# EAGLE design 8stepsv2 (EAGLE 7.4.0)
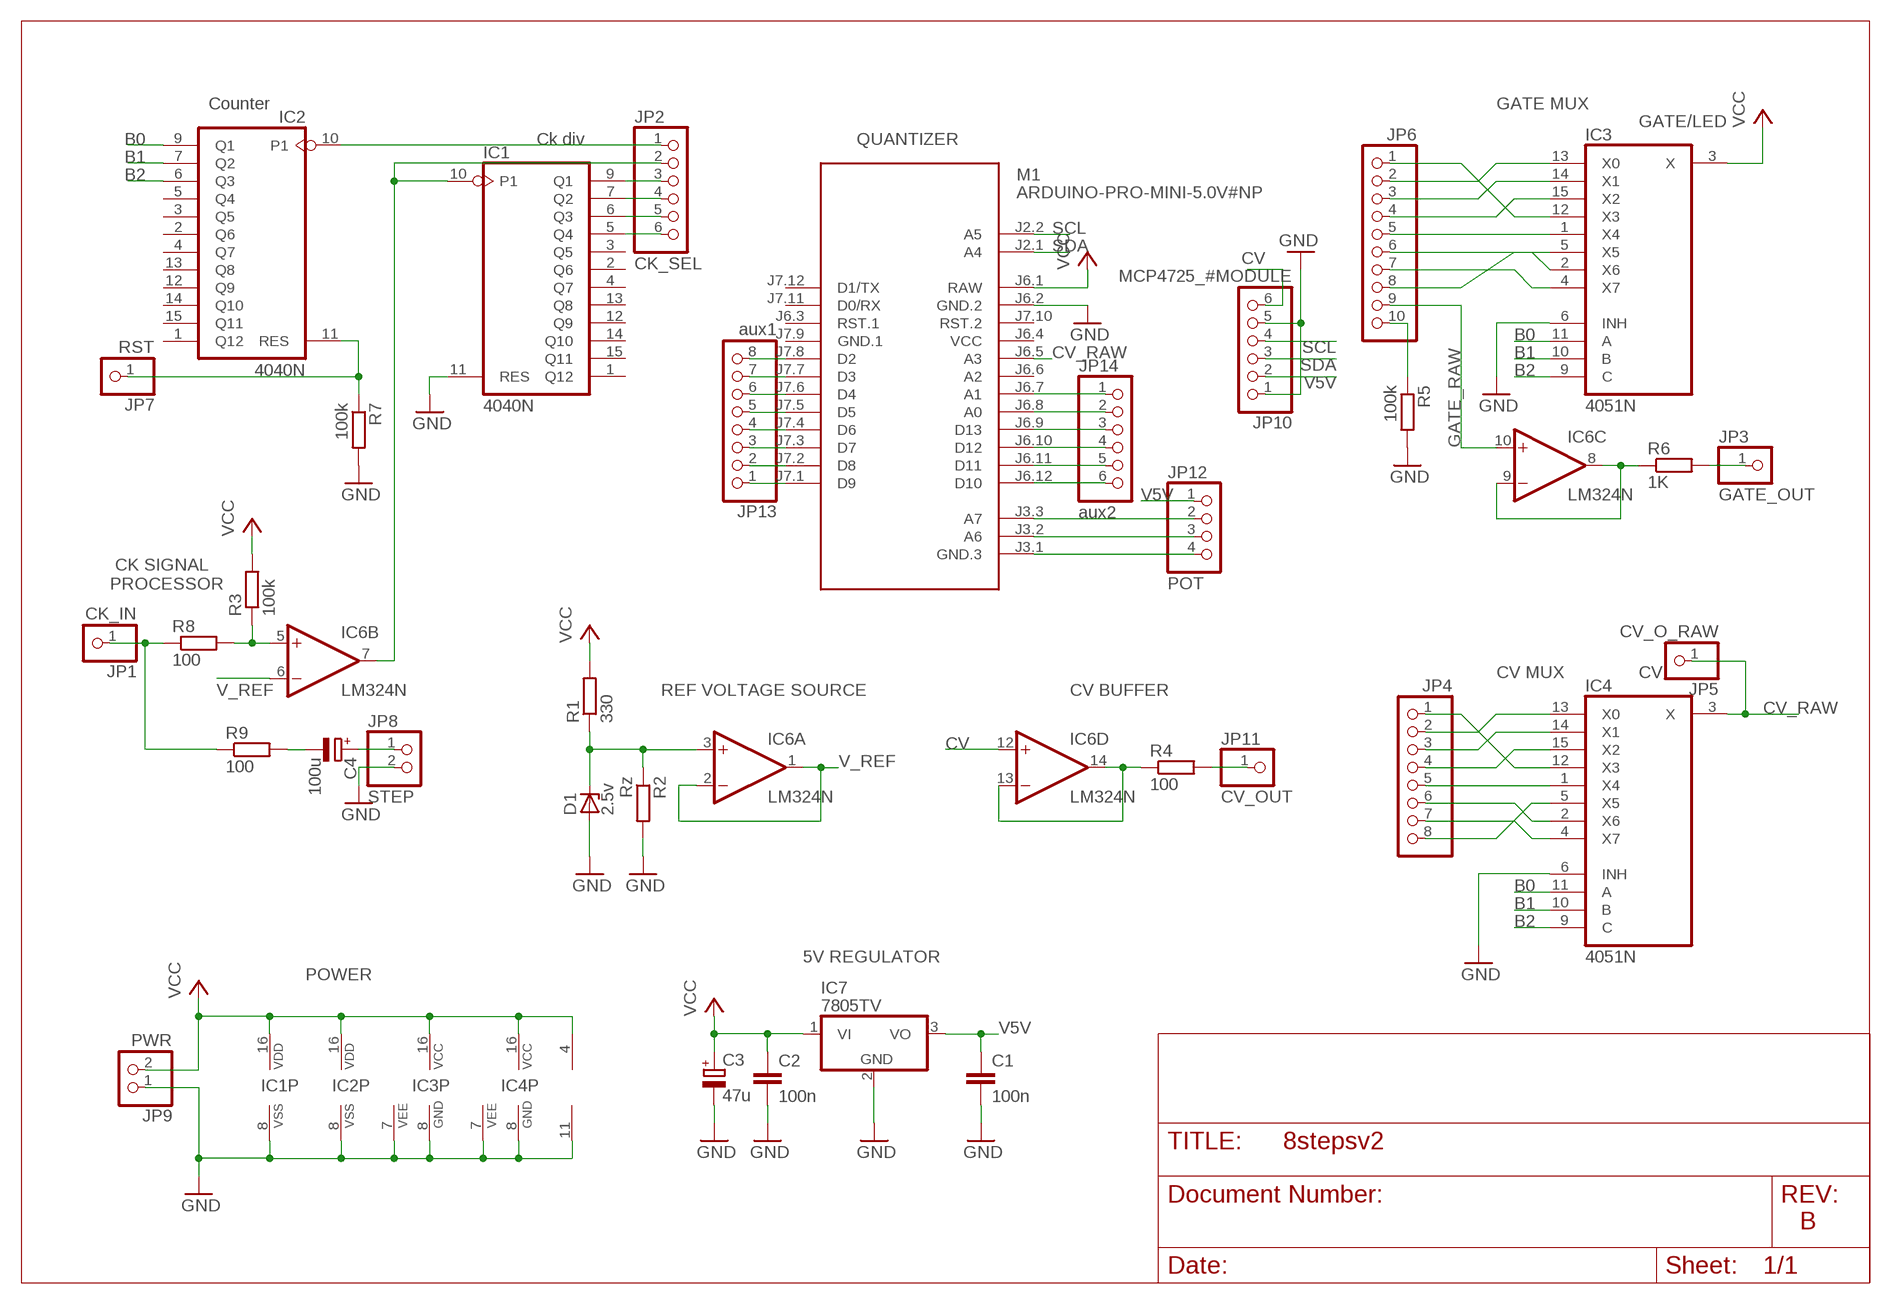
[diagram p0: schematic, sheet 1]

## Parts
C1  100n  C-EU050-025X075  [C050-025X075]
C2  100n  C-EU050-025X075  [C050-025X075]
C3  47u  CPOL-EUE2.5-7  [E2,5-7]
C4  100u  CPOL-EUE2.5-7  [E2,5-7]
D1  2.5v  ZENER-DIODEZD-2.5  [ZDIO-2.5]
IC1  4040N  [DIL16]
IC2  4040N  [DIL16]
IC3  4051N  [DIL16]
IC4  4051N  [DIL16]
IC6  LM324N  [DIL14]
IC7  7805TV  [TO220V]
JP1  CK_IN  PINHD-1X1  [1X01]
JP2  CK_SEL  PINHD-1X6  [1X06]
JP3  GATE_OUT  PINHD-1X1  [1X01]
JP4  PINHD-1X8  [1X08]
JP5  CV_O_RAW  PINHD-1X1  [1X01]
JP6  PINHD-1X10  [1X10]
JP7  RST  PINHD-1X1  [1X01]
JP8  STEP  PINHD-1X2  [1X02]
JP9  PWR  PINHD-1X2  [1X02]
JP10  MCP4725_#MODULE  PINHD-1X6  [1X06]
JP11  CV_OUT  PINHD-1X1  [1X01]
JP12  POT  PINHD-1X4  [1X04]
JP13  aux1  PINHD-1X8  [1X08]
JP14  aux2  PINHD-1X6  [1X06]
M1  ARDUINO-PRO-MINI-5.0V#NP  [ARDUINO-PRO-MINI#NP]
R1  330  R-EU_0207/2V  [0207/2V]
R2  Rz  R-EU_0207/2V  [0207/2V]
R3  100k  R-EU_0207/2V  [0207/2V]
R4  100  R-EU_0207/2V  [0207/2V]
R5  100k  R-EU_0207/2V  [0207/2V]
R6  1K  R-EU_0207/2V  [0207/2V]
R7  100k  R-EU_0207/2V  [0207/2V]
R8  100  R-EU_0207/2V  [0207/2V]
R9  100  R-EU_0207/2V  [0207/2V]

## Nets
B0: IC2.9(Q1) IC3.11(A) IC4.11(A)
B1: IC2.7(Q2) IC3.10(B) IC4.10(B)
B2: IC2.6(Q3) IC3.9(C) IC4.9(C)
CV: IC6.12(D:+IN) JP10.6
CV_RAW: IC4.3(X) JP5.1 M1.J6.5(A3)
GATE_RAW: IC6.10(C:+IN) JP6.9
GND: C1.2 C2.2 C3.- D1.A IC1.8(VSS) IC1.11(RES) IC2.8(VSS) IC3.6(INH) IC3.7(VEE) IC3.8(GND) IC4.6(INH) IC4.7(VEE) IC4.8(GND) IC6.11(P:V-) IC7.2(GND) JP8.2 JP9.1 JP10.1 JP10.5 JP12.4 M1.J3.1(GND.3) M1.J6.2(GND.2) R2.2 R5.2 R7.2
N$1: D1.C IC6.3(A:+IN) R1.1 R2.1
N$2: JP1.1 R8.1 R9.1
N$3: JP13.1 M1.J7.1(D9)
N$4: IC1.10(P1) IC6.7(B:OUT) JP2.2
N$5: IC1.9(Q1) JP2.3
N$6: IC1.7(Q2) JP2.4
N$7: IC1.6(Q3) JP2.5
N$8: IC1.5(Q4) JP2.6
N$9: IC2.10(P1) JP2.1
N$10: IC3.12(X3) JP6.1
N$11: IC3.13(X0) JP6.2
N$12: IC3.14(X1) JP6.3
N$13: IC3.15(X2) JP6.4
N$14: IC3.2(X6) JP6.6
N$15: IC3.5(X5) JP6.8
N$16: IC3.4(X7) JP6.7
N$17: IC3.1(X4) JP6.5
N$18: IC4.12(X3) JP4.1
N$19: IC4.13(X0) JP4.2
N$20: IC4.14(X1) JP4.3
N$21: IC4.15(X2) JP4.4
N$22: IC4.1(X4) JP4.5
N$23: IC4.2(X6) JP4.6
N$24: IC4.4(X7) JP4.7
N$25: IC4.5(X5) JP4.8
N$26: IC6.13(D:-IN) IC6.14(D:OUT) R4.1
N$27: JP11.1 R4.2
N$28: JP6.10 R5.1
N$29: IC2.11(RES) JP7.1 R7.1
N$30: IC6.8(C:OUT) IC6.9(C:-IN) R6.1
N$31: JP3.1 R6.2
N$32: C4.- R9.2
N$33: IC6.5(B:+IN) R3.1 R8.2
N$34: C4.+ JP8.1
N$35: JP12.3 M1.J3.2(A6)
N$36: JP12.2 M1.J3.3(A7)
N$37: JP13.2 M1.J7.2(D8)
N$38: JP13.3 M1.J7.3(D7)
N$39: JP13.4 M1.J7.4(D6)
N$40: JP13.5 M1.J7.5(D5)
N$41: JP13.6 M1.J7.6(D4)
N$42: JP13.7 M1.J7.7(D3)
N$43: JP13.8 M1.J7.8(D2)
N$45: JP14.1 M1.J6.7(A1)
N$46: JP14.2 M1.J6.8(A0)
N$47: JP14.3 M1.J6.9(D13)
N$48: JP14.4 M1.J6.10(D12)
N$49: JP14.5 M1.J6.11(D11)
N$50: JP14.6 M1.J6.12(D10)
SCL: JP10.4 M1.J2.2(A5)
SDA: JP10.3 M1.J2.1(A4)
V5V: C1.1 IC7.3(VO) JP10.2 JP12.1
V_REF: IC6.1(A:OUT) IC6.2(A:-IN) IC6.6(B:-IN)
VCC: C2.1 C3.+ IC1.16(VDD) IC2.16(VDD) IC3.3(X) IC3.16(VCC) IC4.16(VCC) IC6.4(P:V+) IC7.1(VI) JP9.2 M1.J6.1(RAW) R1.2 R3.2
Unconnected: IC1.1(Q12) IC1.2(Q6) IC1.3(Q5) IC1.4(Q7) IC1.12(Q9) IC1.13(Q8) IC1.14(Q10) IC1.15(Q11) IC2.1(Q12) IC2.2(Q6) IC2.3(Q5) IC2.4(Q7) IC2.5(Q4) IC2.12(Q9) IC2.13(Q8) IC2.14(Q10) IC2.15(Q11) M1.J6.3(RST.1) M1.J6.6(A2) M1.J7.10(RST.2) M1.J7.11(D0/RX) M1.J7.12(D1/TX)

## Notes on the sheet
- Counter | GATE MUX
- GATE/LED
- Ck div | QUANTIZER
- CK SIGNAL
  PROCESSOR
- CV MUX | CV
- REF VOLTAGE SOURCE | CV BUFFER
- 5V REGULATOR
- POWER
- B

## Power pins joined to a net without a drawn wire
GND.1: M1.J7.9(GND.1)
VCC: M1.J6.4(VCC)

## Library data of the parts
C1 C2 = rcl:C-EU: CAPACITOR, European symbol
C3 C4 = rcl:CPOL-EU: POLARIZED CAPACITOR, European symbol
D1 = diode:ZENER-DIODE: Z-Diode
IC1 IC2 = 40xx:4040: 12-stage binary/ripple COUNTER
IC3 IC4 = 40xx:4051: 8-channel ANALOG MULTIPLEXER
IC6 = linear:LM324: OP AMP
IC7 = linear:78*: Positive VOLTAGE REGULATOR Source: http://cache.national.com/ds/LM/LM78L05.pdf http://www.fairchildsemi.com/ds/LM/LM7805.pdf
JP1 JP3 JP5 JP7 JP11 = pinhead:PINHD-1X1: PIN HEADER
JP2 JP10 JP14 = pinhead:PINHD-1X6: PIN HEADER
JP4 JP13 = pinhead:PINHD-1X8: PIN HEADER
JP6 = pinhead:PINHD-1X10: PIN HEADER
JP8 JP9 = pinhead:PINHD-1X2: PIN HEADER
JP12 = pinhead:PINHD-1X4: PIN HEADER
M1 = diy-modules:ARDUINO-PRO-MINI-*#NP: Arduino Pro Mini (and compatible devices) without programming pads More details available here: https://www.arduino.cc/en/Main/ArduinoBoardProMini Click here to find device on ebay.com <http://www.ebay.com/sch/arduino+pro+mini>
R1-R9 = rcl:R-EU_: RESISTOR, European symbol

## Board
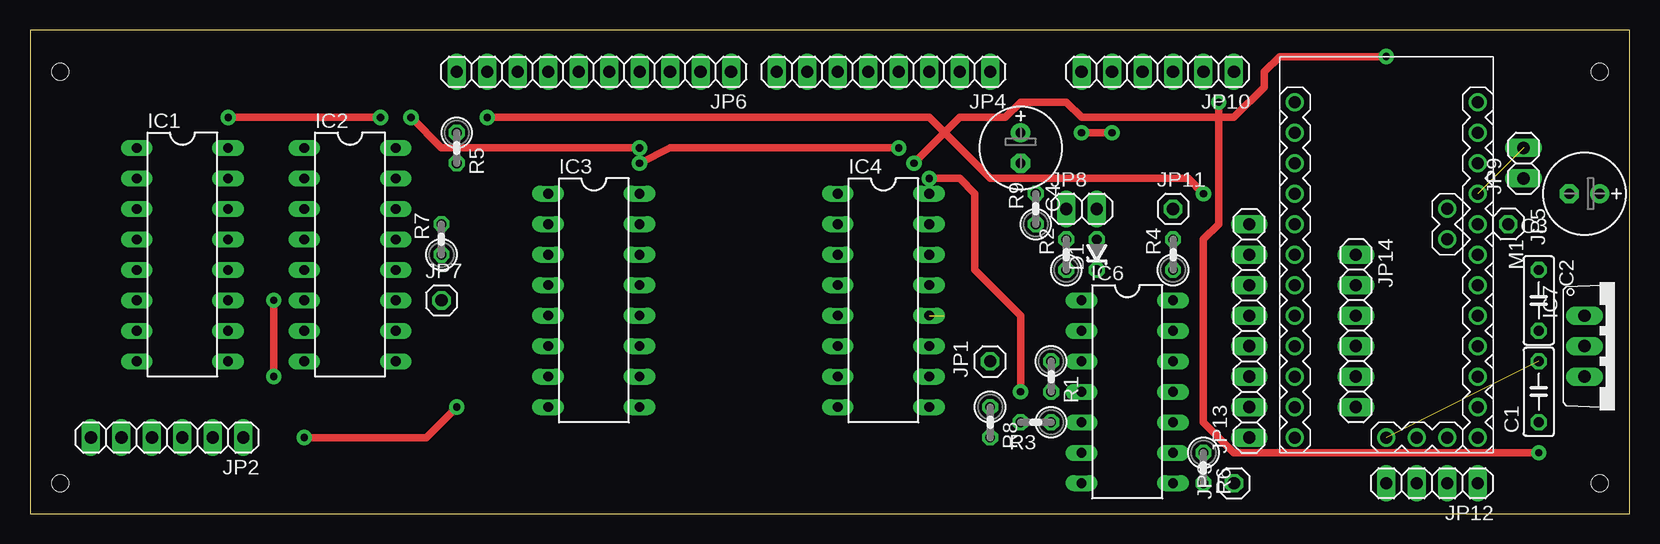
[diagram p1: board, top side]
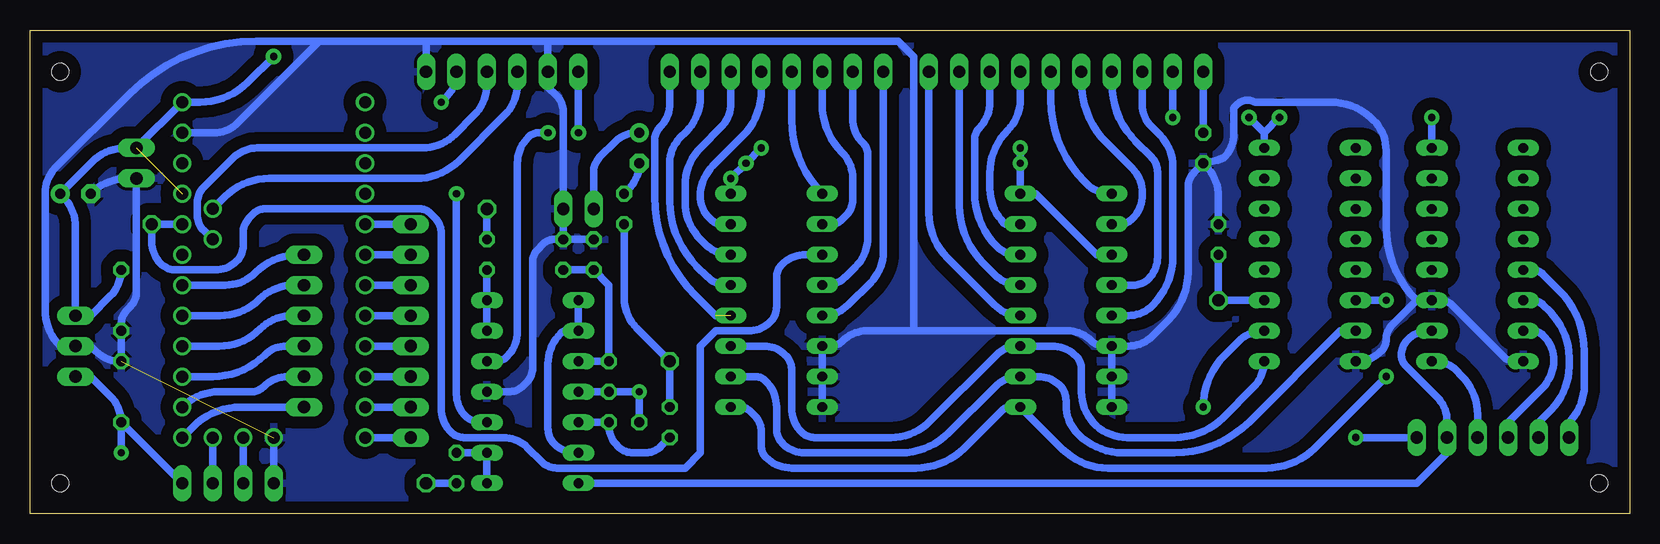
[diagram p2: board, bottom side, seen from below]

Size 133.33 x 40.31 mm. Coordinates in mm from the lower left corner, seen from the top.
Outline: 0,0 133.33,0 133.33,40.31 0,40.31 0,0
Copper layers (1*16): Top 0.035mm / dielectric 1.5mm / Bottom 0.035mm
Design rules "default": minimum track width 10mil, minimum drill 24mil, track to track 8mil, track to pad 8mil, pad to pad 8mil, via to via 8mil, smd to smd 8mil, copper to edge 40mil, drill to drill 8mil, minimum pad ring 10mil, minimum via ring 8mil, stop-mask expansion 4mil, vias tented up to drill 0mil, thermal gap 10mil
Holes 1.4 mm at 2.54,36.83 2.54,2.54 130.81,2.54 130.81,36.83

### Footprints (pad centres in the part's own frame; a part is rotated, then mirrored left to right if it is on the bottom)
C050-025X075 = drill 0.813 octagon: 1 -2.54,0; 2 2.54,0
E2,5-7 = drill 0.813 pad 1.6: + -1.27,0 | drill 0.813 pad 1.6 octagon: - 1.27,0
ZDIO-2.5 = drill 0.813 octagon: A 1.27,0; C -1.27,0
DIL16 = drill 0.813 long: 1 -8.89,-3.81; 2 -6.35,-3.81; 3 -3.81,-3.81; 4 -1.27,-3.81; 5 1.27,-3.81; 6 3.81,-3.81; 7 6.35,-3.81; 8 8.89,-3.81; 9 8.89,3.81; 10 6.35,3.81; 11 3.81,3.81; 12 1.27,3.81; 13 -1.27,3.81; 14 -3.81,3.81; 15 -6.35,3.81; 16 -8.89,3.81
DIL14 = drill 0.813 long: 1 -7.62,-3.81; 2 -5.08,-3.81; 3 -2.54,-3.81; 4 0,-3.81; 5 2.54,-3.81; 6 5.08,-3.81; 7 7.62,-3.81; 8 7.62,3.81; 9 5.08,3.81; 10 2.54,3.81; 11 0,3.81; 12 -2.54,3.81; 13 -5.08,3.81; 14 -7.62,3.81
TO220V = drill 1.016 long: 1 -2.54,-2.54; 2 0,-2.54; 3 2.54,-2.54
1X01 = drill 1.016 octagon: 1 0,0
1X06 = drill 1.016 long: 1 -6.35,0; 2 -3.81,0; 3 -1.27,0; 4 1.27,0; 5 3.81,0; 6 6.35,0
1X08 = drill 1.016 long: 1 -8.89,0; 2 -6.35,0; 3 -3.81,0; 4 -1.27,0; 5 1.27,0; 6 3.81,0; 7 6.35,0; 8 8.89,0
1X10 = drill 1.016 long: 1 -11.43,0; 2 -8.89,0; 3 -6.35,0; 4 -3.81,0; 5 -1.27,0; 6 1.27,0; 7 3.81,0; 8 6.35,0; 9 8.89,0; 10 11.43,0
1X02 = drill 1.016 long: 1 -1.27,0; 2 1.27,0
1X04 = drill 1.016 long: 1 -3.81,0; 2 -1.27,0; 3 1.27,0; 4 3.81,0
ARDUINO-PRO-MINI#NP = drill 1: J2.1 -1.27,5.08; J2.2 -3.81,5.08; J3.1 15.24,0; J3.2 15.24,2.54; J3.3 15.24,5.08; J6.1 -12.7,7.62; J6.2 -10.16,7.62; J6.3 -7.62,7.62; J6.4 -5.08,7.62; J6.5 -2.54,7.62; J6.6 0,7.62; J6.7 2.54,7.62; J6.8 5.08,7.62; J6.9 7.62,7.62; J6.10 10.16,7.62; J6.11 12.7,7.62; J6.12 15.24,7.62; J7.1 15.24,-7.62; J7.2 12.7,-7.62; J7.3 10.16,-7.62; J7.4 7.62,-7.62; J7.5 5.08,-7.62; J7.6 2.54,-7.62; J7.7 0,-7.62; J7.8 -2.54,-7.62; J7.9 -5.08,-7.62; J7.10 -7.62,-7.62; J7.11 -10.16,-7.62; J7.12 -12.7,-7.62
0207/2V = drill 0.813 octagon: 1 -1.27,0; 2 1.27,0

### Placement (x,y rotation side)
C1  125.73,10.16 90 top
C2  125.73,17.78 270 top
C3  129.54,26.67 180 top
C4  82.55,30.48 270 top
D1  88.9,21.59 90 top
IC1  12.7,21.59 270 top
IC2  26.67,21.59 270 top
IC3  46.99,17.78 270 top
IC4  71.12,17.78 270 top
IC6  91.44,10.16 270 top
IC7  132.08,13.97 270 top
JP1  80.01,12.7 90 top
JP2  11.43,6.35 180 top
JP3  100.33,2.54 90 top
JP4  71.12,36.83 180 top
JP5  123.19,24.13 270 top
JP6  46.99,36.83 180 top
JP7  34.29,17.78 0 top
JP8  87.63,25.4 0 top
JP9  124.46,29.21 90 top
JP10  93.98,36.83 180 top
JP11  95.25,25.4 0 top
JP12  116.84,2.54 180 top
JP13  101.6,15.24 90 top
JP14  110.49,15.24 270 top
M1  113.03,21.59 270 top
R1  85.09,11.43 270 top
R2  86.36,21.59 90 top
R3  83.82,7.62 180 top
R4  95.25,21.59 90 top
R5  35.56,30.48 270 top
R6  97.79,3.81 270 top
R7  34.29,22.86 90 top
R8  80.01,7.62 270 top
R9  83.82,25.4 90 top

### Tracks (layer width: path | path; a pad name or v marks a point on that pad's centre or on a via)
B0
  Bottom 0.61: IC4.11 72.17,13.97 arc45 70.38,13.23 arc45 69.85,11.96 69.85,8.8 arc-45 69.02,6.79 arc-45 67.96,6.35 61.59,6.35 arc-45 58.35,7.69 52.81,13.23 arc45 51.02,13.97 IC3.11 48.17,13.97 arc45 46.16,13.14 arc45 45.72,12.08 45.72,10.16 arc-90 41.91,6.35 37.91,6.35 arc-45 33.9,8.01 31.38,10.53 arc-45 IC2.9
B1
  Bottom 0.61: IC4.10 72.92,11.43 arc45 72.02,11.06 arc45 71.12,8.89 71.12,7.09 arc-45 70.59,5.82 arc-45 68.8,5.08 60.77,5.08 arc-45 56.76,6.74 52.9,10.6 arc45 50.89,11.43 IC3.10 49.31,11.43 arc45 47.52,10.69 arc45 46.99,9.42 46.99,9.04 arc-45 45.98,6.61 arc-45 42.28,5.08 37.97,5.08 arc-45 31.69,7.68 24.13,15.24 IC2.7
B2  (via drill 0.6 pad 1.27)
  Top 0.61: v20.32,17.78 v20.32,11.43
  Bottom 0.61: IC4.9 74.19,8.89 arc45 73.29,8.52 72.92,8.15 arc45 72.39,6.88 72.39,5.61 arc-45 72.02,4.71 arc-45 69.85,3.81 59.5,3.81 arc-45 55.49,5.47 52.44,8.52 arc45 51.54,8.89 IC3.9 47.3,5.39 arc-45 43.49,3.81 30.29,3.81 arc-45 26.28,5.47 v20.32,11.43 | IC2.6 v20.32,17.78
CV  (via drill 0.6 pad 1.27)
  Top 0.61: v90.17,31.75 v87.63,31.75
  Bottom 0.61: IC6.12 94.51,12.7 arc-45 93.61,13.07 93.54,13.14 arc-45 92.71,15.15 92.71,29.21 arc45 91.81,31.38 arc45 90.91,31.75 v90.17,31.75 | v87.63,31.75 JP10.6
CV_RAW
  Bottom 0.61: IC4.3 68.67,21.59 arc-45 70.68,20.76 arc-45 71.12,19.7 71.12,17.25 arc45 71.65,15.98 arc45 73.44,15.24 76.2,15.24 77.47,13.97 77.47,5.08 78.74,3.81 89.43,3.81 arc45 90.7,4.34 91.88,5.52 arc-45 93.89,6.35 97.17,6.35 arc45 98.23,6.79 arc45 99.06,8.8 99.06,23.39 arc-45 99.59,24.66 99.96,25.03 arc-45 100.86,25.4 113.77,25.4 arc-45 114.67,25.03 115.04,24.66 arc-45 115.57,23.39 115.57,22.33 arc45 116.1,21.06 arc45 117.89,20.32 121.18,20.32 arc45 122.45,20.85 arc45 123.19,22.64 JP5.1 M1.J6.5
GATE_RAW  (via drill 0.6 pad 1.27)
  Top 0.61: v38.1,33.02 74.93,33.02 80.01,27.94 96.52,27.94 v97.79,26.67
  Bottom 0.61: JP6.9 v38.1,33.02 | v97.79,26.67 97.79,9.94 arc-45 97.05,8.15 arc-45 95.78,7.62 IC6.10
GND  (1 unrouted)
  Bottom 0.61: IC3.6 IC3.7 IC3.8 | R2.2 D1.A | IC6.11 93.45,10.16 arc-45 92.18,10.69 91.97,10.9 arc-45 91.44,12.17 91.44,21.06 arc45 91.07,21.96 90.54,22.49 arc45 89.64,22.86 D1.A | R7.2 34.29,26.45 arc-45 35.34,28.99 R5.2 | IC3.6 41.82,13.97 arc-45 39.81,14.8 38.49,16.12 arc-45 36.83,20.13 36.83,27.2 arc45 36.3,28.47 R5.2 | IC3.6 43.83,13.97 arc45 44.89,14.41 arc-45 46.9,15.24 59.69,15.24 | IC4.8 IC4.7 IC4.6 66.66,13.97 arc-45 65.6,14.41 arc45 63.59,15.24 59.69,15.24 | C3.- arc45 125.2,27.94 JP9.1 124.46,18.52 arc45 124.99,17.25 125.2,17.04 arc-45 125.73,15.77 C2.2 C1.2 125.82,12.7 arc45 127.83,13.53 128.27,13.97 IC7.2 130.81,13.97 arc45 132.08,17.04 132.08,26.76 arc45 131.25,28.77 125,35.02 arc45 114.49,39.37 109.22,39.37 | 59.69,15.24 59.69,38.1 60.96,39.37 90.17,39.37 | IC1.8 9.63,12.7 arc45 10.53,13.07 14.87,17.41 arc-45 15.77,17.78 IC1.11 17.78,17.78 | 17.78,17.78 arc45 20.32,23.91 20.32,30.26 arc-45 21.37,32.8 arc-45 24.96,34.29 31.22,34.29 arc-90 33.02,33.76 33.02,31.66 arc45 33.85,29.65 arc9 R5.2 | 17.78,17.78 19.79,15.77 arc-45 20.32,14.5 arc45 20.69,13.6 20.76,13.53 arc45 22.77,12.7 IC2.8 | D1.A JP8.2 88.9,33.55 arc-45 89.43,34.82 90.17,35.56 JP10.5 90.17,39.37 | 90.17,39.37 100.33,39.37 | JP10.1 100.33,39.37 | M1.J3.1 JP12.4 | 100.33,39.37 109.22,39.37 | M1.J6.2 118.02,31.75 arc-45 116.01,32.58 109.22,39.37
  pour Bottom (isolate 1.016): 0,40.64 133.35,40.64 133.35,0 0,0
N$1
  Bottom 0.61: D1.C R2.1 85.09,19.05 R1.1 IC6.3
N$2
  Bottom 0.61: R9.1 83.82,18 arc-45 82.77,15.46 JP1.1 R8.1
N$3
  Bottom 0.61: JP13.1 M1.J7.1
N$4
  Bottom 0.61: IC1.10 16.73,15.24 arc-45 18.52,14.5 arc-45 19.05,13.23 arc-45 18.68,12.33 16.07,9.72 arc45 15.24,7.71 JP2.2 15.24,5.08 17.78,2.54 IC6.7
N$5
  Bottom 0.61: IC1.9 16.29,12.7 arc45 14.5,11.96 14.04,11.5 arc45 12.7,8.26 JP2.3
N$6
  Bottom 0.61: JP2.4 10.16,7.62 7.31,10.47 arc-45 6.35,12.79 arc-45 7.18,14.8 7.25,14.87 arc-45 8.15,15.24 IC1.7
N$7
  Bottom 0.61: IC1.6 8.15,17.78 arc45 7.25,17.41 6.66,16.82 arc45 5.08,13.01 5.08,12.26 arc45 6.57,8.67 7.62,7.62 JP2.5
N$8
  Bottom 0.61: JP2.6 5.08,7.62 arc-45 3.81,10.69 3.81,13.53 arc-45 5.91,18.61 7.25,19.95 arc-45 8.15,20.32 IC1.5
N$9  (via drill 0.6 pad 1.27)
  Top 0.61: v22.86,6.35 33.02,6.35 v35.56,8.89
  Bottom 0.61: JP2.1 v22.86,6.35 | v35.56,8.89 arc45 33.76,13.23 32.65,14.34 arc45 IC2.10
N$10
  Bottom 0.61: JP6.1 58.42,25.03 arc-45 56.89,21.33 52.97,17.41 arc-45 IC3.12
N$11
  Bottom 0.61: JP6.2 55.88,25.69 arc-45 53.88,20.86 52.97,19.95 arc-45 IC3.13
N$12
  Bottom 0.61: JP6.3 53.34,34.29 arc45 54.24,32.12 arc-45 54.61,31.22 54.61,26.76 arc-45 52.75,22.27 arc-45 51.11,21.59 IC3.14
N$13
  Bottom 0.61: JP6.4 50.8,34.51 arc45 51.85,31.97 arc-45 53.34,28.38 53.34,27.06 arc-45 52.16,24.22 arc-45 51.94,24.13 IC3.15
N$14
  Bottom 0.61: JP6.6 45.72,36 arc-45 43.62,30.92 41.47,28.77 arc45 40.64,26.76 40.64,26.58 arc45 41.47,24.57 arc45 42.53,24.13 IC3.2
N$15
  Bottom 0.61: JP6.8 40.64,34.07 arc-45 39.9,32.28 39.15,31.53 arc45 38.1,28.99 38.1,21.4 arc45 39.76,17.39 39.81,17.34 arc45 41.82,16.51 IC3.5
N$16
  Bottom 0.61: JP6.7 43.18,35.85 arc-45 41.18,31.02 39.9,29.74 arc45 39.37,28.47 39.37,21.37 arc45 40.11,19.58 arc45 41.38,19.05 IC3.4
N$17
  Bottom 0.61: JP6.5 48.26,34.49 arc-45 45.43,27.65 45.28,27.5 arc-45 43.27,26.67 IC3.1
N$18  (1 unrouted)
  Bottom 0.61: JP4.1 80.01,34.2 arc45 80.84,32.19 arc-45 81.28,31.13 81.28,26.44 arc-45 77.85,18.16 76.2,16.51
N$19
  Bottom 0.61: JP4.2 77.47,34.68 arc45 78.65,31.84 79.18,31.31 arc-45 80.01,29.3 80.01,26.06 arc-45 77.75,20.6 76.94,19.79 arc-45 75.15,19.05 IC4.13
N$20
  Bottom 0.61: JP4.3 74.93,34.2 arc45 75.76,32.19 77.4,30.55 arc-45 78.74,27.31 78.74,26.03 arc-45 77.4,22.79 77.1,22.49 arc-45 IC4.14
N$21
  Bottom 0.61: JP4.4 72.39,35.25 arc45 73.97,31.44 76.42,28.99 arc-45 77.47,26.45 arc-45 76.73,24.66 76.57,24.5 arc-45 75.67,24.13 IC4.15
N$22
  Bottom 0.61: JP4.5 69.85,32.8 arc-45 IC4.1
N$23
  Bottom 0.61: JP4.6 67.31,34.1 arc-45 65.65,30.09 arc45 64.77,27.97 64.77,26.14 arc45 65.3,24.87 65.67,24.5 arc45 66.57,24.13 IC4.2
N$24
  Bottom 0.61: JP4.7 64.77,32.93 arc-45 63.94,30.92 arc45 63.5,29.86 63.5,23.08 arc45 64.55,20.54 65.3,19.79 arc45 67.09,19.05 IC4.4
N$25
  Bottom 0.61: JP4.8 62.23,21.81 arc45 63.28,19.27 65.14,17.41 arc45 IC4.5
N$26
  Bottom 0.61: IC6.13 IC6.14 R4.1
N$27
  Bottom 0.61: JP11.1 R4.2
N$28
  Bottom 0.61: JP6.10 R5.1
N$29
  Bottom 0.61: IC2.11 JP7.1 R7.1
N$30
  Bottom 0.61: IC6.8 IC6.9 R6.1
N$31
  Bottom 0.61: R6.2 JP3.1
N$32
  Bottom 0.61: C4.- arc45 83.45,27.04 R9.2
N$33
  Bottom 0.61: R8.2 80.75,5.61 arc45 82.02,5.08 83.08,5.08 arc45 84.35,5.61 arc45 85.09,7.4 R3.1 IC6.5
N$34
  Bottom 0.61: C4.+ 82.77,31.75 arc-45 84.56,31.01 85.83,29.74 arc-45 86.36,28.47 JP8.1
N$35
  Bottom 0.61: M1.J3.2 JP12.3
N$36
  Bottom 0.61: M1.J3.3 JP12.2
N$37
  Bottom 0.61: JP13.2 M1.J7.2
N$38
  Bottom 0.61: JP13.3 M1.J7.3
N$39
  Bottom 0.61: M1.J7.4 JP13.4
N$40
  Bottom 0.61: JP13.5 M1.J7.5
N$41
  Bottom 0.61: JP13.6 M1.J7.6
N$42
  Bottom 0.61: JP13.7 M1.J7.7
N$43
  Bottom 0.61: M1.J7.8 JP13.8
N$45
  Bottom 0.61: JP14.1 110.93,21.59 arc-45 114.52,20.1 arc45 117.06,19.05 M1.J6.7
N$46
  Bottom 0.61: M1.J6.8 117.5,16.51 arc-45 114.21,17.87 arc45 111.37,19.05 JP14.2
N$47
  Bottom 0.61: JP14.3 111.45,16.51 arc-45 114.15,15.39 arc45 117.58,13.97 M1.J6.9
N$48
  Bottom 0.61: JP14.4 111.98,13.97 arc-45 113.77,13.23 arc45 118.11,11.43 M1.J6.10
N$49
  Bottom 0.61: JP14.5 111.85,11.43 arc-45 113.86,10.6 arc45 114.92,10.16 117.58,10.16 arc-45 M1.J6.11
N$50
  Bottom 0.61: JP14.6 115.76,8.89 arc-45 119.77,7.23 M1.J6.12
SCL
  Bottom 0.61: M1.J2.2 117.1,26.41 arc45 113.4,27.94 101.16,27.94 arc-45 97.57,29.43 93.76,33.24 arc-45 92.71,35.78 JP10.4
SDA
  Bottom 0.61: JP10.3 95.25,35.78 arc45 96.3,33.24 97.94,31.6 arc45 100.64,30.48 114.39,30.48 arc-45 116.4,29.65 118.85,27.2 arc-45 119.38,25.93 119.38,24.87 arc-45 118.85,23.6 M1.J2.1
V5V  (via drill 0.6 pad 1.27)
  Top 0.61: v99.06,34.29 99.06,24.13 97.79,22.86 97.79,7.62 100.33,5.08 v125.73,5.08
  Bottom 0.61: C1.1 arc-45 126.63,9.79 128.27,11.43 IC7.3 | JP12.1 C1.1 | JP10.2 arc45 98.69,34.66 v99.06,34.29 | v125.73,5.08 C1.1
V_REF
  Bottom 0.61: IC6.1 IC6.2 88.59,15.24 arc-45 89.12,15.02 arc-45 90.17,12.48 90.17,7.09 arc-45 89.64,5.82 arc-45 87.85,5.08 IC6.6
VCC  (via drill 0.6 pad 1.27)  (1 unrouted)
  Top 0.61: v16.51,33.02 v29.21,33.02 | v50.8,30.48 34.29,30.48 v31.75,33.02 | v72.39,30.48 53.34,30.48 v50.8,29.21 | v74.93,27.94 77.47,27.94 78.74,26.67 78.74,20.32 82.55,16.51 v82.55,10.16 | v113.03,38.1 104.14,38.1 102.87,36.83 102.87,35.56 100.33,33.02 87.63,33.02 86.36,34.29 82.55,34.29 81.28,33.02 77.47,33.02 v73.66,29.21
  Bottom 0.61: IC1.16 v16.51,33.02 | IC3.3 44.45,21.59 49.53,26.67 IC3.16 v50.8,29.21 v50.8,30.48 | IC6.4 R1.2 v82.55,10.16 R3.2 | v29.21,33.02 30.48,31.75 | 30.48,31.75 IC2.16 | v31.75,33.02 30.48,31.75 | v72.39,30.48 v73.66,29.21 v74.93,27.94 IC4.16 | C2.1 arc45 126.63,18.15 128.27,16.51 IC7.1 129.54,23.91 arc-45 130.59,26.45 C3.+ 128.18,29.3 arc45 125.34,30.48 JP9.2 M1.J6.1 119.19,34.29 arc-45 115.18,35.95 v113.03,38.1

### Text on the board
Document: 6 8 7 5 3 2 1 4 | 6 8 7 5 3 2 1 4 | 8 STEP / SEQUENCER | by / gAz '22